# Altium schematic sheet power.SchDoc
size A4
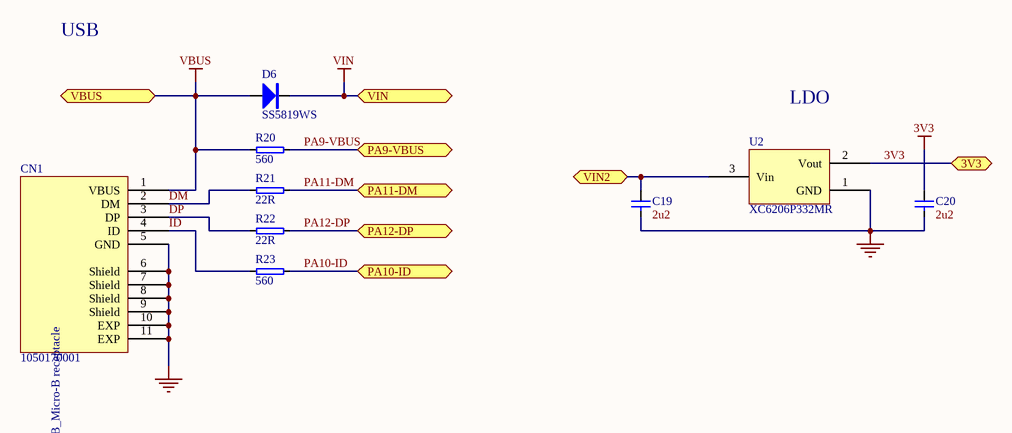
[diagram p0: power.SchDoc]

## Parts
C19  2u2  [SMD0603]
C20  2u2  [SMD0603]
CN1  1050170001  [MOLEX_1050170001]
D6  SS5819WS  [1N5819-SOD323]
R20  560  [SMD0402]
R21  22R  [SMD0402]
R22  22R  [SMD0402]
R23  560  [SMD0402]
U2  XC6206P332MR  [SOT-23_N]

## Ports
3V3, PA9-VBUS, PA10-ID, PA11-DM, PA12-DP, VBUS, VIN, VIN2

## Nets
3V3: C20.2 U2.2(Vout) ; port 3V3
GND: C19.1 C20.1 CN1.5(GND) CN1.6(Shield) CN1.7(Shield) CN1.8(Shield) CN1.9(Shield) CN1.10(EXP) CN1.11(EXP) U2.1(GND)
VBUS: CN1.1(VBUS) D6.1 R20.2 ; port VBUS
VIN: D6.2 ; port VIN
DM: CN1.2(DM) R21.2
DP: CN1.3(DP) R22.2
ID: CN1.4(ID) R23.2
PA9-VBUS: R20.1 ; port PA9-VBUS
PA10-ID: R23.1 ; port PA10-ID
PA11-DM: R21.1 ; port PA11-DM
PA12-DP: R22.1 ; port PA12-DP
VIN2: C19.2 U2.3(Vin) ; port VIN2

## Notes on the sheet
- USB
- LDO
- (in symbol 1050170001) USB_Micro-B receptacle

## Library data of the parts
C19 C20 = Cap
CN1 = 1050170001: Silkscreen: USB
D6 = Diode
R20-R23 = Res
U2 = XC6206